# EAGLE design Board (EAGLE 8.2.2)
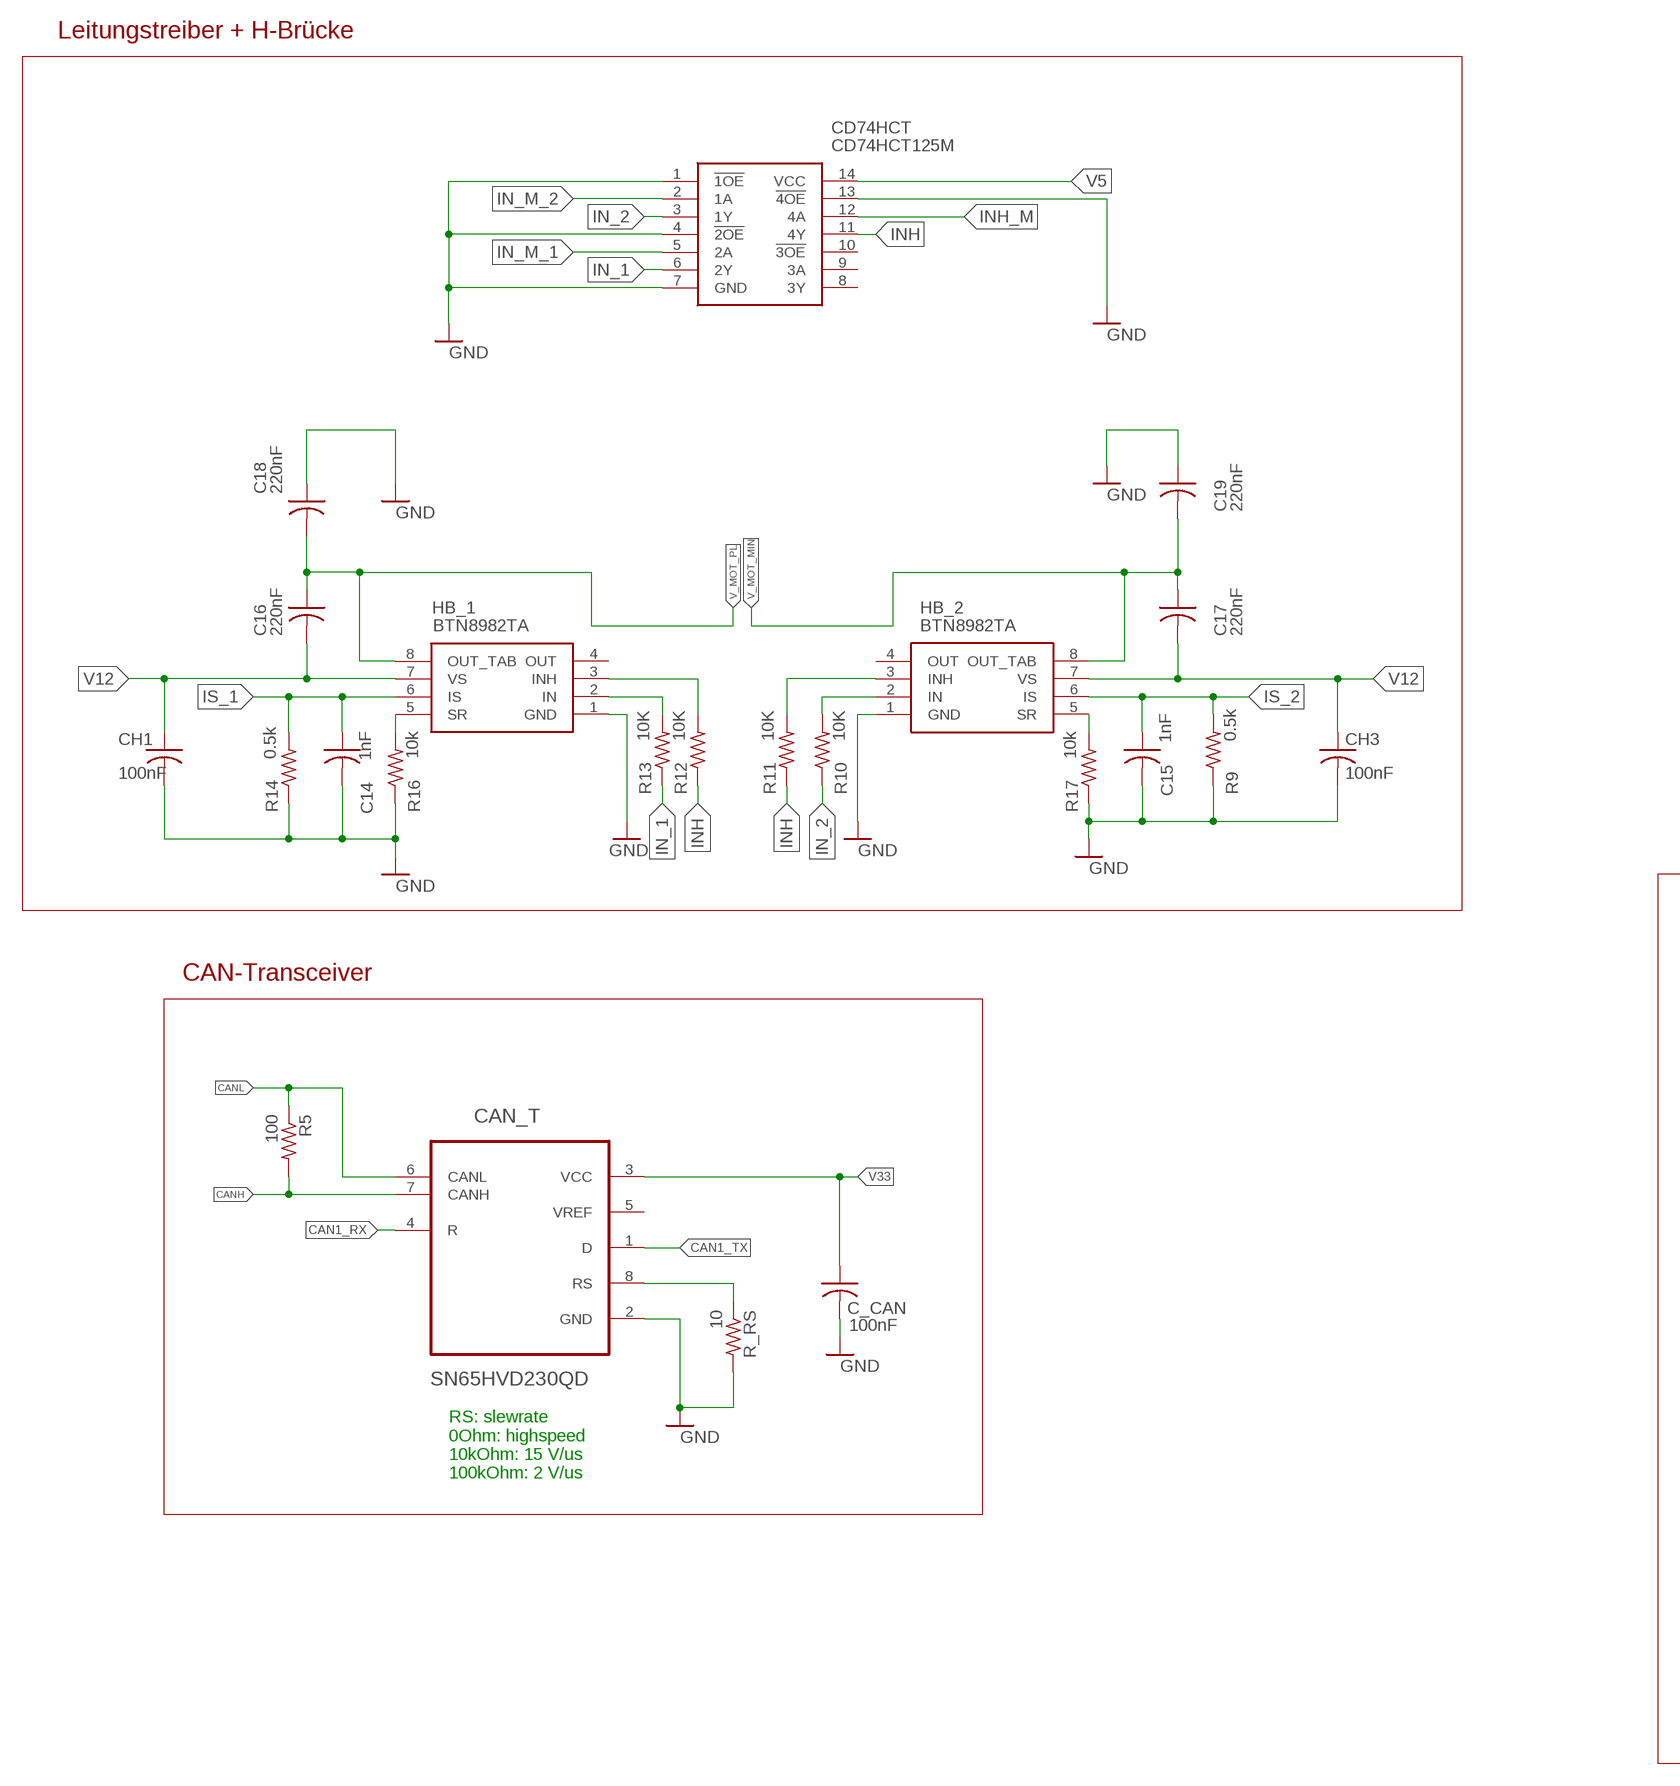
[diagram p0: schematic, sheet 1, part 1 of 2]
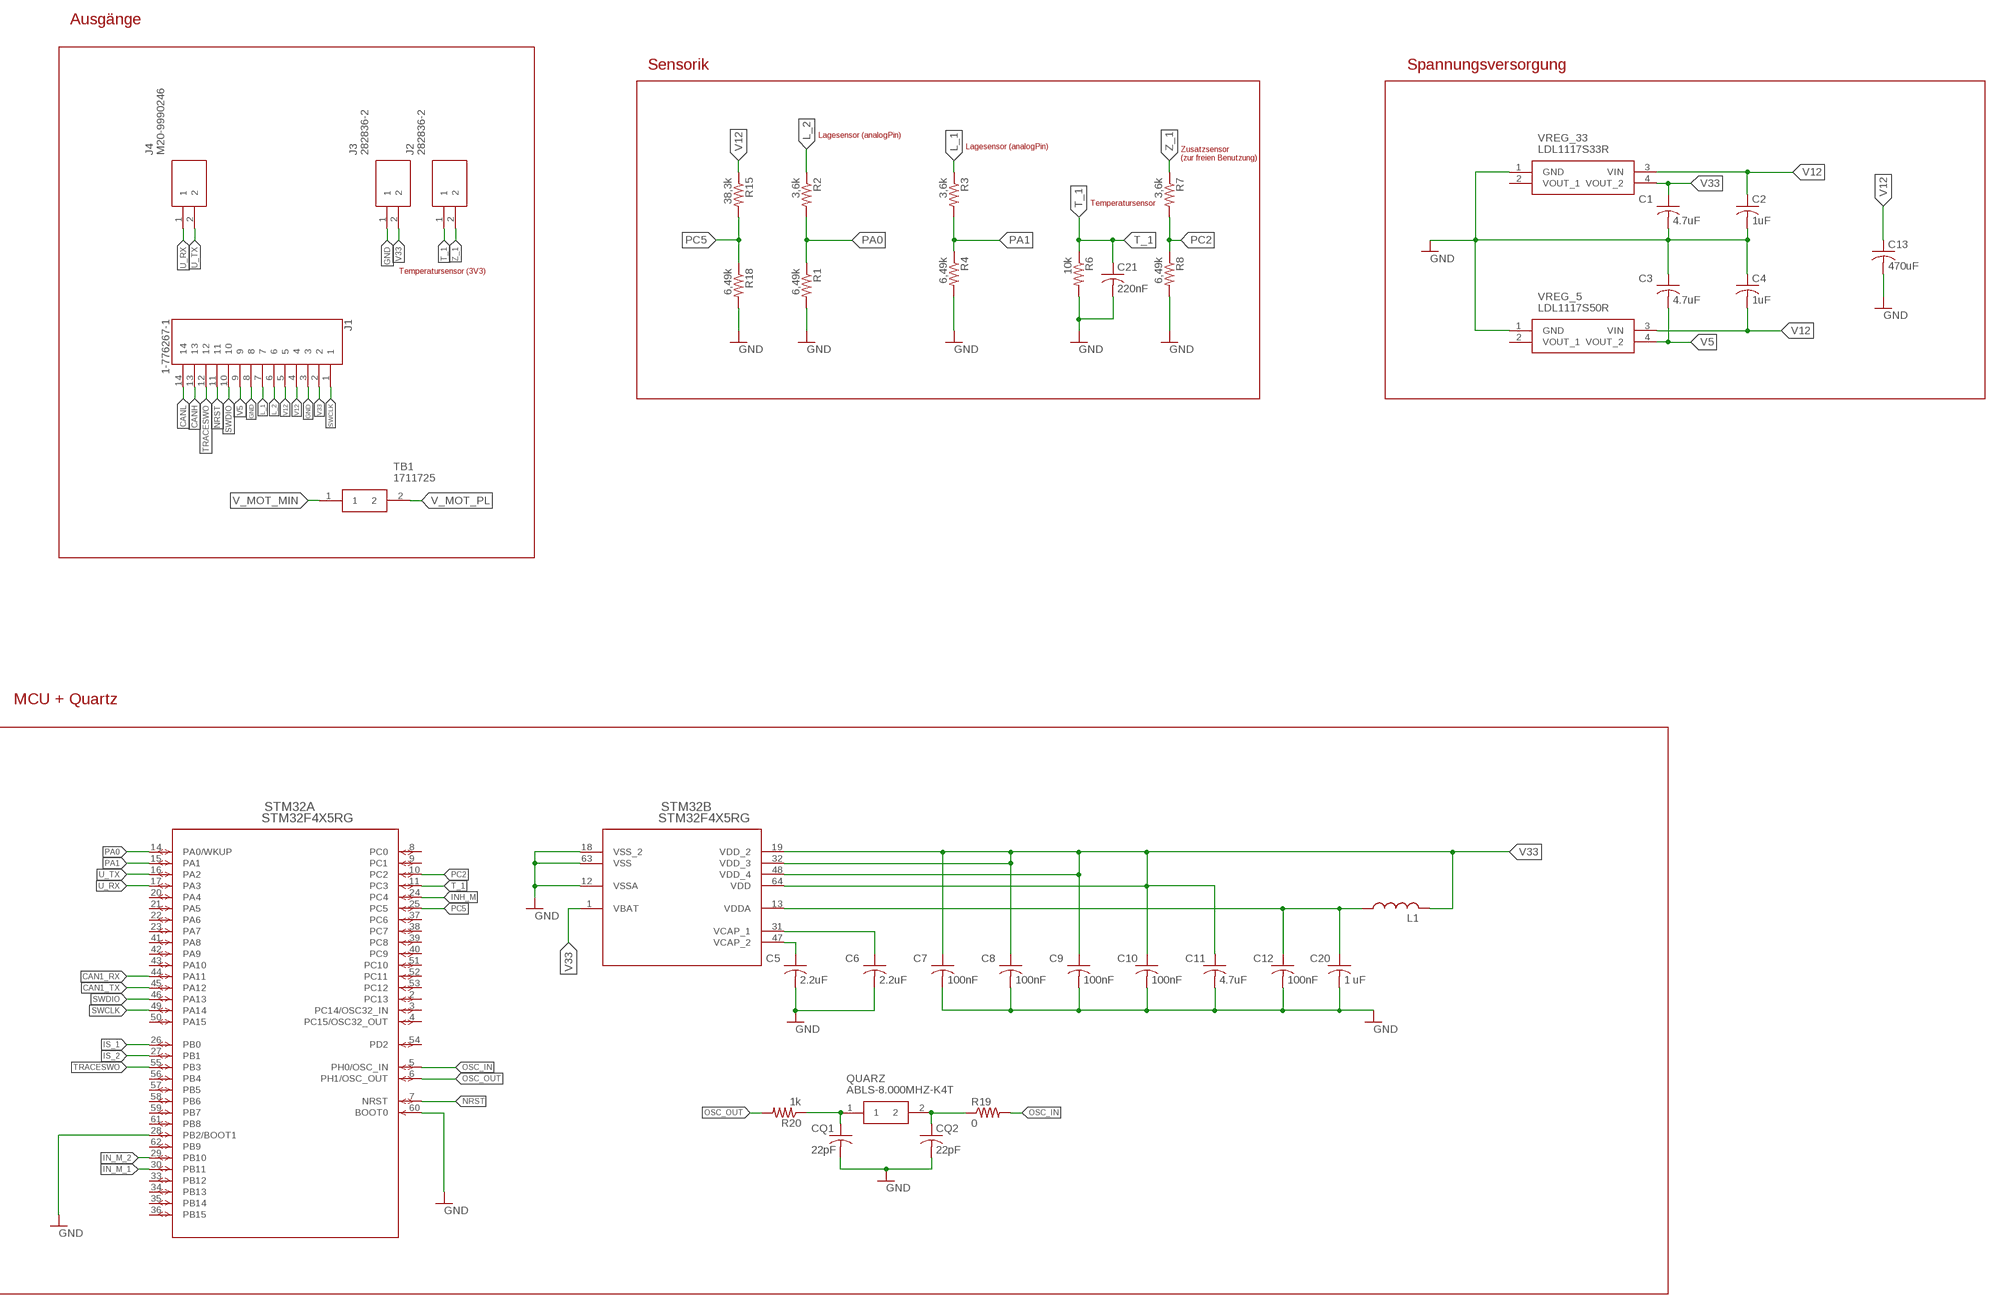
[diagram p1: schematic, sheet 1, part 2 of 2]

## Parts
C1  4.7uF  C-USC1206  [C1206]
C2  1uF  C-USC1206  [C1206]
C3  4.7uF  C-USC1206  [C1206]
C4  1uF  C-USC1206  [C1206]
C5  2.2uF  C-USC1206  [C1206]
C6  2.2uF  C-USC1206  [C1206]
C7  100nF  C-USC1206  [C1206]
C8  100nF  C-USC1206  [C1206]
C9  100nF  C-USC1206  [C1206]
C10  100nF  C-USC1206  [C1206]
C11  4.7uF  C-USC1206  [C1206]
C12  100nF  C-USC1206  [C1206]
C13  470uF  C-US050-075X075  [C050-075X075]
C14  1nF  C-USC1206  [C1206]
C15  1nF  C-USC1206  [C1206]
C16  220nF  C-USC1206  [C1206]
C17  220nF  C-USC1206  [C1206]
C18  220nF  C-USC1206  [C1206]
C19  220nF  C-USC1206  [C1206]
C20  1 uF  C-USC1206  [C1206]
C21  220nF  C-USC1206  [C1206]
C_CAN  100nF  C-USC1206  [C1206]
CAN_T  SN65HVD230QD  [SOIC127P600X175-8N]
CD74HCT  CD74HCT125M  [SOIC127P600X175-14N]
CH1  100nF  C-USC1206  [C1206]
CH3  100nF  C-USC1206  [C1206]
CQ1  22pF  C-USC0805  [C0805]
CQ2  22pF  C-USC0805  [C0805]
HB_1  BTN8982TA  [TO127P1500X440-8N]
HB_2  BTN8982TA  [TO127P1500X440-8N]
J1  1-776267-1  [TE_1-776267-1]
J2  282836-2  [SHDR2W100P0X500_1X2_1000X820X1]
J3  282836-2  [SHDR2W100P0X500_1X2_1000X820X1]
J4  M20-9990246  [HDRV2W64P0X254_1X2_508X254X864]
L1  INDUCTOR_0805_N  [RESC0805_N]
QUARZ  ABLS-8.000MHZ-K4T  [ABLS-12.000MHZ-B2]
R1  6,49k  R-US_R1206  [R1206]
R2  3,6k  R-US_R1206  [R1206]
R3  3,6k  R-US_R1206  [R1206]
R4  6,49k  R-US_R1206  [R1206]
R5  100  R-US_R1206  [R1206]
R6  10k  R-US_R1206  [R1206]
R7  3,6k  R-US_R1206  [R1206]
R8  6,49k  R-US_R1206  [R1206]
R9  0.5k  R-US_R1206  [R1206]
R10  10K  R-US_R1206  [R1206]
R11  10K  R-US_R1206  [R1206]
R12  10K  R-US_R1206  [R1206]
R13  10K  R-US_R1206  [R1206]
R14  0.5k  R-US_R1206  [R1206]
R15  38,3k  R-US_R1206  [R1206]
R16  10k  R-US_R0805  [R0805]
R17  10k  R-US_R0805  [R0805]
R18  6,49k  R-US_R1206  [R1206]
R19  0  R-US_R0805  [R0805]
R20  1k  R-US_R0805  [R0805]
R_RS  10  R-US_R1206  [R1206]
STM32  STM32F4X5RG  [LQFP64-10X10MM]
TB1  1711725  [PHEONIX-5.08PITCH-2PIN]
VREG_5  LDL1117S50R  [SOT230P700X180-4N]
VREG_33  LDL1117S33R  [SOT230P700X180-4N]

## Nets
CAN1_RX: CAN_T.4(R) STM32.44(A:PA11)
CAN1_TX: CAN_T.1(D) STM32.45(A:PA12)
CAN_RS: CAN_T.8(RS) R_RS.1
CANH: CAN_T.7(CANH) J1.13 R5.2
CANL: CAN_T.6(CANL) J1.14 R5.1
GND: C1.2 C2.2 C3.1 C4.1 C5.2 C6.2 C7.2 C8.2 C9.2 C10.2 C11.2 C12.2 C13.2 C14.2 C15.2 C18.1 C19.1 C20.2 C21.2 C_CAN.2 CAN_T.2(GND) CD74HCT.1(!1OE) CD74HCT.4(!2OE) CD74HCT.7(GND) CD74HCT.13(!4OE) CH1.2 CH3.2 CQ1.2 CQ2.2 HB_1.1(GND) HB_2.1(GND) J1.3 J1.8 J3.1 R1.2 R4.2 R6.2 R8.2 R9.1 R14.1 R16.1 R17.1 R18.2 R_RS.2 STM32.12(B:VSSA) STM32.18(B:VSS_2) STM32.28(A:PB2/BOOT1) STM32.60(A:BOOT0) STM32.63(B:VSS) VREG_5.1(GND) VREG_33.1(GND)
HB1_IN: HB_1.2(IN) R13.2
HB1_INH: HB_1.3(INH) R12.2
HB2_IN: HB_2.2(IN) R10.2
HB2_INH: HB_2.3(INH) R11.2
IN_1: CD74HCT.6(2Y) R13.1
IN_2: CD74HCT.3(1Y) R10.1
IN_M_1: CD74HCT.5(2A) STM32.30(A:PB11)
IN_M_2: CD74HCT.2(1A) STM32.29(A:PB10)
INH: CD74HCT.11(4Y) R11.1 R12.1
INH_M: CD74HCT.12(4A) STM32.24(A:PC4)
IS_1: C14.1 HB_1.6(IS) R14.2 STM32.26(A:PB0)
IS_2: C15.1 HB_2.6(IS) R9.2 STM32.27(A:PB1)
L_1: J1.7 R3.1
L_2: J1.6 R2.1
NRST: J1.11 STM32.7(A:NRST)
OSC_IN: R19.2 STM32.5(A:PH0/OSC_IN)
OSC_OUT: R20.2 STM32.6(A:PH1/OSC_OUT)
PA0: R1.1 R2.2 STM32.14(A:PA0/WKUP)
PA1: R3.2 R4.1 STM32.15(A:PA1)
PC2: R7.2 R8.1 STM32.10(A:PC2)
PC5: R15.2 R18.1 STM32.25(A:PC5)
Q_IN: CQ2.1 QUARZ.2 R19.1
Q_OUT: CQ1.1 QUARZ.1 R20.1
SR1: HB_1.5(SR) R16.2
SR2: HB_2.5(SR) R17.2
SWCLK: J1.1 STM32.49(A:PA14)
SWDIO: J1.10 STM32.46(A:PA13)
T_1: C21.1 J2.1 R6.1 STM32.11(A:PC3)
TRACESWO: J1.12 STM32.55(A:PB3)
U_RX: J4.1 STM32.17(A:PA3)
U_TX: J4.2 STM32.16(A:PA2)
V5: C3.2 CD74HCT.14(VCC) J1.9 VREG_5.4(VOUT_2)
V12: C2.1 C4.2 C13.1 C16.2 C17.2 CH1.1 CH3.1 HB_1.7(VS) HB_2.7(VS) J1.4 J1.5 R15.1 VREG_5.3(VIN) VREG_33.3(VIN)
V33: C1.1 C7.1 C8.1 C9.1 C10.1 C11.1 C_CAN.1 CAN_T.3(VCC) J1.2 J3.2 L1.2 STM32.1(B:VBAT) STM32.19(B:VDD_2) STM32.32(B:VDD_3) STM32.48(B:VDD_4) STM32.64(B:VDD) VREG_33.4(VOUT_2)
V_MOT_MIN: C17.1 C19.2 HB_2.8(OUT_TAB) TB1.1
V_MOT_PL: C16.1 C18.2 HB_1.8(OUT_TAB) TB1.2
VCAP_1: C6.1 STM32.31(B:VCAP_1)
VCAP_2: C5.1 STM32.47(B:VCAP_2)
VDDA: C12.1 C20.1 L1.1 STM32.13(B:VDDA)
Z_1: J2.2 R7.1
Unconnected: CAN_T.5(VREF) CD74HCT.8(3Y) CD74HCT.9(3A) CD74HCT.10(!3OE) HB_1.4(OUT) HB_2.4(OUT) STM32.2(A:PC13) STM32.3(A:PC14/OSC32_IN) STM32.4(A:PC15/OSC32_OUT) STM32.8(A:PC0) STM32.9(A:PC1) STM32.20(A:PA4) STM32.21(A:PA5) STM32.22(A:PA6) STM32.23(A:PA7) STM32.33(A:PB12) STM32.34(A:PB13) STM32.35(A:PB14) STM32.36(A:PB15) STM32.37(A:PC6) STM32.38(A:PC7) STM32.39(A:PC8) STM32.40(A:PC9) STM32.41(A:PA8) STM32.42(A:PA9) STM32.43(A:PA10) STM32.50(A:PA15) STM32.51(A:PC10) STM32.52(A:PC11) STM32.53(A:PC12) STM32.54(A:PD2) STM32.56(A:PB4) STM32.57(A:PB5) STM32.58(A:PB6) STM32.59(A:PB7) STM32.61(A:PB8) STM32.62(A:PB9) VREG_5.2(VOUT_1) VREG_33.2(VOUT_1)

## Notes on the sheet
- Ausgänge
- Sensorik | Spannungsversorgung
- Lagesensor (analogPin)
- Lagesensor (analogPin)
- Zusatzsensor
  (zur freien Benutzung)
- Leitungstreiber + H-Brücke
- Temperatursensor
- Temperatursensor (3V3)
- MCU + Quartz
- CAN-Transceiver
- RS: slewrate
  0Ohm: highspeed
  10kOhm: 15 V/us
  100kOhm: 2 V/us

## Library data of the parts
C1-C21 C_CAN CH1 CH3 CQ1 CQ2 = adafruit:C-US: CAPACITOR, American symbol
CAN_T = ADP_Components:SN65HVD230QD: 3.3-V CAN TRANSCEIVERS; MF: TEXAS INSTRUMENTS; MPN: SN65HVD230QD..; OC_FARNELL: 1648752; OC_NEWARK: 75C7746; PACKAGE: SOIC-8; SUPPLIER: Texas Instruments
CD74HCT = SamacSys_Parts:CD74HCT125M: High Speed CMOS Logic Quad Buffers with 3-State Outputs Source: Datasheet <http://www.ti.com/lit/ds/symlink/cd74hct125.pdf>; DESCRIPTION: High Speed CMOS Logic Quad Buffers with 3-State Outputs; HEIGHT: 1.75mm; MANUFACTURER_NAME: Texas Instruments; MANUFACTURER_PART_NUMBER: CD74HCT125M; MOUSER_PART_NUMBER: 595-CD74HCT125M
HB_1 HB_2 = SamacSys_Parts:BTN8982TA: New Infineon BTN8982TA Motor Driver,, 7-Pin TO-263-7-1 Source: Datasheet <http://www.mouser.com/datasheet/2/196/Infineon-BTN8982TA-DS-v01_00-EN-786008.pdf>; DESCRIPTION: New Infineon BTN8982TA Motor Driver,, 7-Pin TO-263-7-1; HEIGHT: 4.4mm; MANUFACTURER_NAME: Infineon; MANUFACTURER_PART_NUMBER: BTN8982TA; MOUSER_PART_NUMBER: 726-BTN8982TA
J1 = 1-776267-1:1-776267-1: AMPSEAL 14 Position 4 mm Pitch Triple Row Wire to Board Right Angle Header; COMMENT: 1-776267-1; DESCRIPTION: AMPSEAL 14 Position 4 mm Pitch Triple Row Wire to Board Right Angle Header; DIGI-KEY_PART_NUMBER: A142413-ND; DIGI-KEY_PURCHASE_URL: https://www.digikey.com/product-detail/en/te-connectivity-amp-connectors/1-776267-1/A142413-ND/5428565?utm_source=snapeda&utm_medium=aggregator&utm_campaign=symbol; EU_ROHS_COMPLIANCE: Compliant; MF: TE Connectivity; MP: 1-776267-1; PACKAGE: None; TE_PURCHASE_URL: https://www.te.com/usa-en/product-1-776267-1.html?te_bu=Cor&te_type=disp&te_campaign=seda_glo_cor-seda-global-disp-prtnr-fy19-seda-model-bom-cta_sma-317_1&elqCampaignId=32493
J2 J3 = SamacSys_Parts:282836-2: TERMINAL BLOCK, PCB MOUNT, SIDE WIRE ENTRY, STACKING , 5.00mm PITCH Source: Datasheet <http://www.mouser.com/datasheet/2/418/NG_CD_282836_H10-1248046.pdf>; DESCRIPTION: TERMINAL BLOCK, PCB MOUNT, SIDE WIRE ENTRY, STACKING , 5.00mm PITCH; HEIGHT: 10.2mm; MANUFACTURER_NAME: TE Connectivity; MANUFACTURER_PART_NUMBER: 282836-2; MOUSER_PART_NUMBER: 571-2828362
J4 = SamacSys_Parts:M20-9990246: HARWIN M20-9990246. Board-To-Board Connector, Straight, 2.54 mm, 2 Contacts, Header, M20 Series, Through Hole Source: Datasheet <http://www.mouser.com/datasheet/2/181/M20-999-1218971.pdf>; DESCRIPTION: HARWIN M20-9990246. Board-To-Board Connector, Straight, 2.54 mm, 2 Contacts, Header, M20 Series, Through Hole; HEIGHT: 8.64mm; MANUFACTURER_NAME: HARWIN; MANUFACTURER_PART_NUMBER: M20-9990246; MOUSER_PART_NUMBER: 855-M20-9990246
L1 = Nordic_nRF:INDUCTOR: Generic chip inductor
QUARZ = SamacSys_Parts:ABLS-8.000MHZ-K4T: ABRACON - ABLS-8.000MHZ-K4T - CRYSTAL, 8MHZ, 18PF, HC-49US Source: Datasheet <https://componentsearchengine.com/Datasheets/1/ABLS-8.000MHZ-K4T.pdf>; DESCRIPTION: ABRACON - ABLS-8.000MHZ-K4T - CRYSTAL, 8MHZ, 18PF, HC-49US; HEIGHT: mm; MANUFACTURER_NAME: ABRACON; MANUFACTURER_PART_NUMBER: ABLS-8.000MHZ-K4T; MF: ABRACON; MOUSER_PART_NUMBER: 815-ABLS-8.0MK4-T; MPN: ABLS-8.000MHZ-K4T; OC_FARNELL: 2467758
R1-R15 R18 R_RS = adafruit:R-US_: RESISTOR, American symbol
R16 R17 R19 R20 = resistor:R-US_: RESISTOR, American symbol
STM32 = ADP_Components:STM32F4X5RG; MANUFACTURER_PART_NUMBER: STM32F4X5RG; OC_FARNELL: unknown; VENDOR: STMicroelectronics
TB1 = SamacSys_Parts:1711725: Non-Fused Terminal Block Through Hole, 2 Way, Solder, Nylon, 250 V Source: Datasheet; DESCRIPTION: Non-Fused Terminal Block Through Hole, 2 Way, Solder, Nylon, 250 V; HEIGHT: mm; MANUFACTURER_NAME: Phoenix Contact; MANUFACTURER_PART_NUMBER: 1711725; MOUSER_PART_NUMBER: 651-1711725; MOUSER_PRICE-STOCK: https://www.mouser.com/Search/Refine.aspx?Keyword=651-1711725
VREG_5 = SamacSys_Parts:LDL1117S50R: STMICROELECTRONICS - LDL1117S50R - LDO, FIXED, 5V, 1.2A, SOT-223-3 Source: Datasheet <http://www.mouser.com/datasheet/2/389/ldl1117-1156241.pdf>; DESCRIPTION: STMICROELECTRONICS - LDL1117S50R - LDO, FIXED, 5V, 1.2A, SOT-223-3; HEIGHT: 1.8mm; MANUFACTURER_NAME: STMicroelectronics; MANUFACTURER_PART_NUMBER: LDL1117S50R; MF: STMICROELECTRONICS; MOUSER_PART_NUMBER: 511-LDL1117S50R; MPN: LDL1117S50R; OC_FARNELL: 2729709
VREG_33 = SamacSys_Parts:LDL1117S33R: STMICROELECTRONICS - LDL1117S33R - LDO, FIXED, 3.3V, 1.2A, SOT-223-3 Source: Datasheet <http://www.mouser.com/datasheet/2/389/ldl1117-1156241.pdf>; DESCRIPTION: STMICROELECTRONICS - LDL1117S33R - LDO, FIXED, 3.3V, 1.2A, SOT-223-3; HEIGHT: 1.8mm; MANUFACTURER_NAME: STMicroelectronics; MANUFACTURER_PART_NUMBER: LDL1117S33R; MF: STMICROELECTRONICS; MOUSER_PART_NUMBER: 511-LDL1117S33R; MPN: LDL1117S33R; OC_FARNELL: 2729708

## Net classes
0 default: width 0.2 mm, drill 0.508 mm
1 V12: width 0.6 mm, drill 0.8 mm

## Board
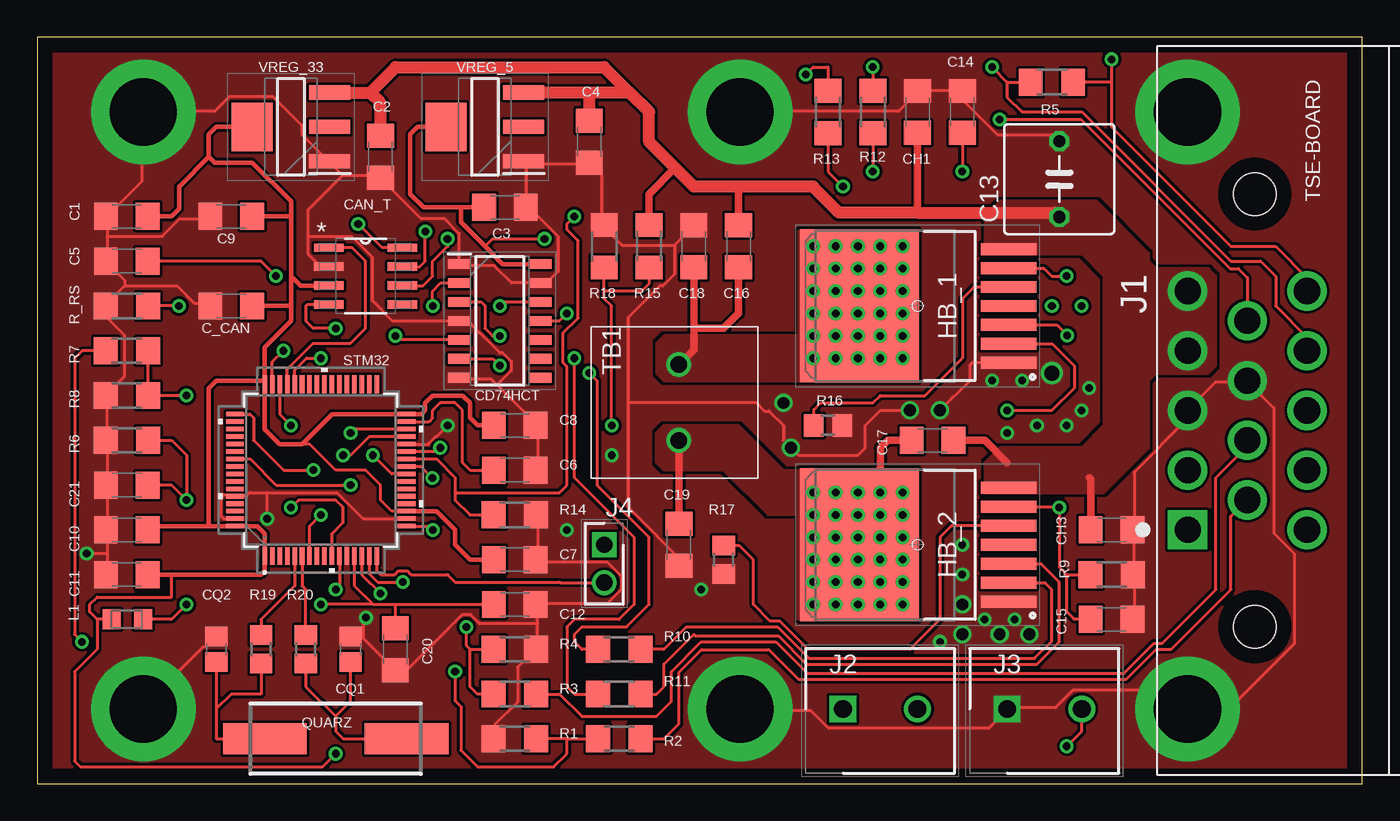
[diagram p2: board, top side]
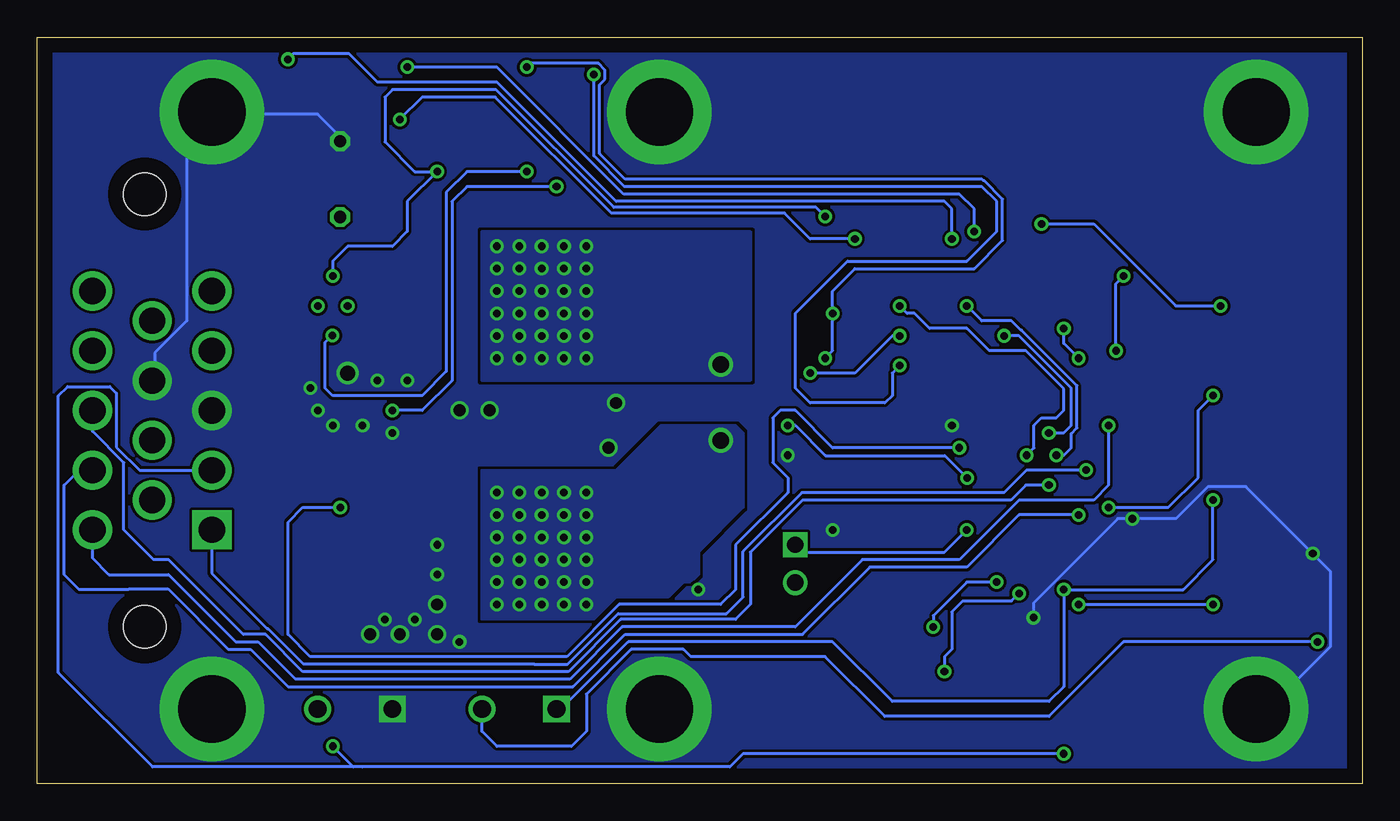
[diagram p3: board, bottom side, seen from below]

Size 88.8 x 50 mm. Coordinates in mm from the lower left corner, seen from the top.
Outline: 0,0 88.8,0 88.8,50 0,50 0,0
Copper layers (1*16): Top 0.07mm / dielectric 1.5mm / Bottom 0.07mm
Design rules "default *": minimum track width 6mil, minimum drill 0.35mm, track to track 0.19mm, track to pad 0.19mm, pad to pad 0.19mm, via to via 0.19mm, smd to smd 0.19mm, copper to edge 40mil, drill to drill 6mil, minimum pad ring 10mil, minimum via ring 8mil, stop-mask expansion 4mil, vias tented up to drill 0mil, thermal gap 10mil

### Footprints (pad centres in the part's own frame; a part is rotated, then mirrored left to right if it is on the bottom)
C1206 = smd 1.6 x 1.8: 1 -1.4,0; 2 1.4,0
C050-075X075 = drill 0.813 octagon: 1 -2.54,0; 2 2.54,0
SOIC127P600X175-8N = smd 1.981 x 0.559: 1 -2.464,1.905; 2 -2.464,0.635; 3 -2.464,-0.635; 4 -2.464,-1.905; 5 2.464,-1.905; 6 2.464,-0.635; 7 2.464,0.635; 8 2.464,1.905
SOIC127P600X175-14N = smd 1.525 x 0.65: 1 -2.712,3.81; 2 -2.712,2.54; 3 -2.712,1.27; 4 -2.712,0; 5 -2.712,-1.27; 6 -2.712,-2.54; 7 -2.712,-3.81; 8 2.712,-3.81; 9 2.712,-2.54; 10 2.712,-1.27; 11 2.712,0; 12 2.712,1.27; 13 2.712,2.54; 14 2.712,3.81
C0805 = smd 1.3 x 1.5: 1 -0.85,0; 2 0.85,0
TO127P1500X440-8N = smd 3.7 x 0.8: 1 -6.1,3.81; 2 -6.1,2.54; 3 -6.1,1.27; 4 -6.1,0; 5 -6.1,-1.27; 6 -6.1,-2.54; 7 -6.1,-3.81 | smd 8 x 10.25: 8 3.9,0
TE_1-776267-1 = drill 1.75 square: 1 -8,4.5 | drill 1.75: 2 -4,4.5; 3 0,4.5; 4 4,4.5; 5 8,4.5; 6 -6,0.5; 7 -2,0.5; 8 2,0.5; 9 6,0.5; 10 -8,-3.5; 11 -4,-3.5; 12 0,-3.5; 13 4,-3.5; 14 8,-3.5 | hole 2.85: -14.5,0; 14.5,0
SHDR2W100P0X500_1X2_1000X820X1 = drill 1.2 pad 1.8 square: 1 0,0 | drill 1.2 pad 1.8: 2 5,0
HDRV2W64P0X254_1X2_508X254X864 = drill 1.1 pad 1.65 square: 1 0,0 | drill 1.1 pad 1.65: 2 2.54,0
RESC0805_N = smd 1.2 x 1.35: 1 -1.1,0; 2 1,0
ABLS-12.000MHZ-B2 = smd 5.6 x 2.1: 1 -4.75,0; 2 4.75,0
R1206 = smd 1.6 x 1.803: 1 -1.422,0; 2 1.422,0
R0805 = smd 1.3 x 1.5: 1 -0.95,0; 2 0.95,0
LQFP64-10X10MM = smd 1.194 x 0.305: 1 -5.75,3.75; 2 -5.75,3.25; 3 -5.75,2.75; 4 -5.75,2.25; 5 -5.75,1.75; 6 -5.75,1.25; 7 -5.75,0.75; 8 -5.75,0.25; 9 -5.75,-0.25; 10 -5.75,-0.75; 11 -5.75,-1.25; 12 -5.75,-1.75; 13 -5.75,-2.25; 14 -5.75,-2.75; 15 -5.75,-3.25; 16 -5.75,-3.75; 33 5.75,-3.75; 34 5.75,-3.25; 35 5.75,-2.75; 36 5.75,-2.25; 37 5.75,-1.75; 38 5.75,-1.25; 39 5.75,-0.75; 40 5.75,-0.25; 41 5.75,0.25; 42 5.75,0.75; 43 5.75,1.25; 44 5.75,1.75; 45 5.75,2.25; 46 5.75,2.75; 47 5.75,3.25; 48 5.75,3.75 | smd 0.305 x 1.194: 17 -3.75,-5.75; 18 -3.25,-5.75; 19 -2.75,-5.75; 20 -2.25,-5.75; 21 -1.75,-5.75; 22 -1.25,-5.75; 23 -0.75,-5.75; 24 -0.25,-5.75; 25 0.25,-5.75; 26 0.75,-5.75; 27 1.25,-5.75; 28 1.75,-5.75; 29 2.25,-5.75; 30 2.75,-5.75; 31 3.25,-5.75; 32 3.75,-5.75; 49 3.75,5.75; 50 3.25,5.75; 51 2.75,5.75; 52 2.25,5.75; 53 1.75,5.75; 54 1.25,5.75; 55 0.75,5.75; 56 0.25,5.75; 57 -0.25,5.75; 58 -0.75,5.75; 59 -1.25,5.75; 60 -1.75,5.75; 61 -2.25,5.75; 62 -2.75,5.75; 63 -3.25,5.75; 64 -3.75,5.75
PHEONIX-5.08PITCH-2PIN = drill 1.1 pad 1.65: 1 0,0; 2 5.08,0
SOT230P700X180-4N = smd 2.75 x 0.95: 1 -2.6,2.3; 2 -2.6,0; 3 -2.6,-2.3 | smd 2.75 x 3.25: 4 2.6,0

### Placement (x,y rotation side)
C1  6,38 180 top
C2  23,42 270 top
C3  31.34,38.61 180 top
C4  37,43 90 top
C5  6,35 180 top
C6  32,21 0 top
C7  32,15 0 top
C8  32,24 0 top
C9  13,38 180 top
C10  6,17 180 top
C11  6,14 180 top
C12  32,12 0 top
C13  68.5,40.5 90 top
C14  62,45 90 top
C15  72,11 0 top
C16  47,36 90 top
C17  60,23 0 top
C18  44,36 270 top
C19  43,16 90 top
C20  24,9 270 top
C21  6,20 180 top
C_CAN  13,32 180 top
CAN_T  22,34 0 top
CD74HCT  31,31 0 top
CH1  59,45 90 top
CH3  72,17 0 top
CQ1  21,9 90 top
CQ2  12,9 90 top
HB_1  59,32 180 top
HB_2  59,16 180 top
J1  81.6,25 90 top
J2  54,5 0 top
J3  65,5 0 top
J4  38,16 270 top
L1  6,11 180 top
QUARZ  20,3 180 top
R1  32,3 180 top
R2  39,3 180 top
R3  32,6 180 top
R4  32,9 0 top
R5  68,47 180 top
R6  6,23 180 top
R7  6,29 0 top
R8  6,26 180 top
R9  72,14 180 top
R10  39,9 0 top
R11  39,6 0 top
R12  56,45 270 top
R13  53,45 270 top
R14  32,18 180 top
R15  41,36 270 top
R16  53,24 180 top
R17  46,15 90 top
R18  38,36 90 top
R19  15,9 90 top
R20  18,9 90 top
R_RS  6,32 180 top
STM32  19,21 90 top
TB1  43,23 90 top
VREG_5  30,44 180 top
VREG_33  17,44 180 top

### Tracks (layer width: path | path; a pad name or v marks a point on that pad's centre or on a via)
CAN1_RX  (via drill 0.51)
  Top 0.2: STM32.44 17.25,27.7 18.05,28.5 v19,28.5 | v20,30.5 18.5,30.5 18,31 18,32 18.09,32.09 CAN_T.4
  Bottom 0.2: v19,28.5 20,29.5 v20,30.5
CAN1_TX
  Top 0.2: STM32.45 16.75,27.75 18.5,29.5 21,29.5 22,30.5 22,35 21.09,35.91 CAN_T.1
CAN_RS  (via drill 0.51)
  Top 0.2: v9.5,32 R_RS.1 | CAN_T.8 23.09,35.91 v21.5,37.5
  Bottom 0.2: v9.5,32 12.5,32 18,37.5 v21.5,37.5
CANH  (via drill 0.51)
  Top 0.2: CAN_T.7 25.64,34.63 26,35 v26,37 | v64,48 65,47 | 65,47 R5.2 | 65,47 65,46 66,45 70,45 80,35 82,35 83,34 83,32 85.1,29.9 J1.13
  Bottom 0.2: v26,37 26,38.5 27,39.5 49.5,39.5 58,48 v64,48
CANL  (via drill 0.51)
  Top 0.2: CAN_T.6 25.86,33.37 26.5,34 26.5,35 27.5,36 v27.5,36.5 | v72,48.53 72,47 | 72,47 R5.1 | 72,47 72,44 80,36 83,36 85.1,33.9 J1.14
  Bottom 0.2: v27.5,36.5 27.5,38.5 28,39 50,39 58,47 66,47 67.88,48.88 71.64,48.88 v72,48.53
GND  (via drill 0.51, 0.8, 1, 4.5 pad 7)
  Top 0.2: v47.1,5 47.19,4.88 51.87,4.88 53.04,3.71 63.77,3.71 64.94,4.88 J3.1 65.13,5.07 68.25,5.07 69.42,6.24 75.86,6.24 77.03,5.07 v77.1,5 77.22,5.07 79.95,5.07 84.24,9.36 84.24,15.4 82.88,16.77 82.88,25.16 81.12,26.91 J1.8 80.92,26.91 78.97,26.91 77.22,25.16 J1.3 77.03,24.96 77.03,24.38 73.52,20.86 73.52,17.16 CH3.2 73.52,16.96 73.52,14.04 R9.1 73.52,13.85 73.52,11.12 C15.2 | v47.1,45 47.19,45.05 57.72,45.05 58.89,46.22 CH1.2 59.09,46.41 61.81,46.41 C14.2 62.01,46.22 62.01,45.83 64.35,43.48 68.06,43.48 C13.2 | 21.84,9.75 21.06,9.75 CQ1.2 | 21.84,9.75 23.98,7.61 C20.2 24.18,7.61 24.77,7.61 28.47,11.31 29.05,11.31 29.64,10.72 33.54,10.72 | R14.1 33.54,17.94 33.54,15.02 C7.2 33.54,14.82 38.22,14.82 39.2,13.85 39.2,13.06 38.22,12.09 33.54,12.09 C12.2 33.54,11.89 33.54,10.72 | 33.54,10.72 33.54,9.16 R4.2 33.34,8.97 32.17,7.8 32.17,5.46 30.61,3.9 30.61,3.12 R1.2 | 5.85,33.34 9.36,33.34 10.53,32.17 11.51,32.17 C_CAN.2 | 5.85,33.34 4.68,32.17 R_RS.2 4.68,31.98 4.68,31.2 5.85,30.03 5.85,27.3 4.68,26.13 R8.2 4.68,25.93 4.68,23.01 R6.2 4.68,22.82 4.68,20.09 C21.2 4.68,19.89 4.68,17.16 C10.2 4.68,16.96 4.68,15.4 | 4.68,36.66 4.68,37.83 C1.2 4.68,38.02 7.02,40.37 7.02,44.85 v7.1,45 7.21,45.05 11.89,45.05 12.87,46.02 15.79,46.02 17.75,44.07 17.75,43.48 19.5,41.73 VREG_33.1 19.7,41.53 20.48,40.76 | 4.68,36.66 4.68,35.1 C5.2 4.68,34.91 5.85,33.73 5.85,33.34 | 4.68,36.66 8.38,36.66 9.55,37.83 11.51,37.83 C9.2 | STM32.63 13.06,17.75 12.48,17.75 12.29,17.94 12.29,19.11 12.48,19.3 13.06,19.3 STM32.60 13.26,19.3 14.04,19.3 14.23,19.5 15.4,19.5
  Top 0.2: 15.4,19.5 20.09,19.5 21.84,17.75 24.57,17.75 STM32.18 | CQ2.2 11.89,9.75 11.31,9.16 11.12,9.16 7.02,5.07 v7.1,5 | 4.68,15.4 4.68,14.04 C11.2 | 4.68,15.4 v3.31,15.4 | v15.4,17.75 15.4,19.5 | 21.84,9.75 21.84,10.92 v22.04,11.12 | 39.59,25.55 39.59,31.2 41.73,33.34 41.92,33.34 42.7,34.12 42.7,36.08 | 39.59,25.55 39.59,18.56 41.53,16.61 41.53,16.57 42.9,15.21 42.9,14.62 C19.1 | 42.7,36.08 43.88,37.24 C18.1 | 30.81,26.71 33.34,24.18 C8.2 33.54,23.98 33.54,21.06 C6.2 | 30.81,26.71 30.42,27.11 28.47,27.11 CD74HCT.7 | 30.81,26.71 31.79,27.69 31.79,28.27 31.2,28.86 31,28.86 29.05,30.81 28.47,30.81 CD74HCT.4 28.27,31 23.79,31 22.43,32.37 22.43,35.3 21.06,36.66 18.14,36.66 | 20.48,40.76 22.82,40.76 C2.2 23.01,40.56 25.74,37.83 27.3,37.83 28.27,36.85 28.27,34.91 CD74HCT.1 28.47,34.71 30.61,34.71 31.79,33.54 CD74HCT.13 34.12,33.54 34.91,34.32 34.91,36.66 32.76,38.8 | 18.14,36.66 18.14,38.41 20.48,40.76 | 18.14,36.66 18.14,35.49 18.91,34.71 19.5,34.71 CAN_T.2 | 32.76,41.53 32.76,38.8 | 32.76,38.8 32.76,38.61 C3.1 32.76,38.8 | 32.76,41.53 36.85,41.53 C4.1 37.05,41.53 37.83,40.76 37.83,37.44 R18.2 38.02,37.24 39.2,36.08 42.7,36.08 | 32.76,41.53 VREG_5.1 | 39.59,25.55 48.16,25.55 48.75,24.96 49.04,24.96 50,24 50,23 | STM32.28 26.25,22.75 26.25,22.81 26.69,23.25 26.75,23.25 v27.5,24 | 51,22 55,22 55.5,22.5 55.5,24 56.5,25 v58.5,25 | 60.46,24.96 v60.5,25 62.5,27 62.5,28 62.69,28.19 HB_1.1
  Bottom 0.2: J1.8 80.92,27.11 80.92,28.86 78.78,31 78.78,43.29 77.22,44.85 v77.1,45 77.03,44.85 70,44.85 68.5,43.34 C13.2 | v7.1,5 7.02,5.07 6.24,5.07 2.15,9.16 2.15,14.23 v3.31,15.4 7.8,19.89 10.34,19.89 12.48,17.75 v15.4,17.75 16.38,17.75 22.04,12.09 v22.04,11.12
  other vias: 68,27.5 62,10 64.5,10 66.5,10 50.5,22.5 50,25.5 62,12 44.5,13 35.5,17 38.5,22 67,24 69,24 70,25 64,27 66,27 62,14 62,16 65.5,11 63.5,11 65,23.5 70.5,26.5 60.5,9.5
  pour Top (rank 2, no thermals): -1,51 -1,-1 90,-1 90,51
  pour Bottom (rank 2, no thermals): -3,52 -3,-1 90,-1 90,52
HB1_IN  (via drill 0.51)
  Top 0.2: R13.2 53,41 v54,40 | v65,25 68,25 69.5,26.5 69.5,28 68.04,29.46 HB_1.2
  Bottom 0.2: v65,25 63,25 61,27 61,39 60,40 v54,40
HB1_INH  (via drill 0.51)
  Top 0.2: R12.2 v56,41 | HB_1.3 68.33,30.73 v69.03,30.03
  Bottom 0.2: v56,41 60,41 61.39,39.61 61.39,27.61 63,26 69,26 69.53,26.53 69.53,29.53 v69.03,30.03
HB2_IN
  Top 0.2: HB_2.2 67.54,13.46 68,13 68,9.55 66.84,8.39 51.71,8.39 49.6,10.5 43.5,10.5 42,9 R10.2
HB2_INH
  Top 0.2: HB_2.3 67.27,14.73 68.5,13.5 68.5,9.5 67,8 51.55,8 49.66,9.89 44.11,9.89 44,10 42,8 42,6.5 41.5,6 R11.2
IN_1  (via drill 0.51)
  Top 0.2: CD74HCT.6 30.54,28.46 v31,28 | v51.5,47.5 52,48 53,48 R13.1
  Bottom 0.2: v31,28 31.5,27.5 31.5,26 32,25.5 37,25.5 38,26.5 38,31.5 34.5,35 26.5,35 24.5,37 24.5,39 25.5,40 49.45,40 51.5,42.05 v51.5,47.5
IN_2  (via drill 0.51)
  Top 0.2: R10.1 36.5,9 36,9.5 36,10 36.5,10.5 39.5,10.5 41,12 41,16.5 37.5,20 37.5,27 v37,27.5 | CD74HCT.3 29.73,32.27 30,32 30,30.5 30.5,30 v31,30
  Bottom 0.2: v31,30 31.5,30 34,27.5 v37,27.5
IN_M_1  (via drill 0.51)
  Top 0.2: STM32.30 21.25,23.75 v21,23.5 | CD74HCT.5 24.27,29.73 v24,30
  Bottom 0.2: v21,23.5 20,23.5 19.5,24 19.5,26.5 23,30 v24,30
IN_M_2  (via drill 0.51)
  Top 0.2: STM32.29 22.25,23.25 21,22 v20.5,22 | v26.5,32 26.5,33 27.04,33.54 CD74HCT.2
  Bottom 0.2: v20.5,22 20,22 19.5,22.5 19.5,23.45 19.11,23.84 19.11,26.66 22.84,30.39 22.89,30.39 23.5,31 25.5,31 v26.5,32
INH  (via drill 0.51)
  Top 0.2: CD74HCT.11 35,31 v35.5,31.5 | R11.1 36,6 35.5,6.5 35.5,10.5 36,11 39,11 40,12 40,16.5 36,20.5 v36,28.5 | v56,48 R12.1
  Bottom 0.2: v56,48 55.75,48.25 51.19,48.25 50.75,47.81 50.75,47.19 51.11,46.83 51.11,42.21 49.4,40.5 25.5,40.5 25.39,40.39 25.34,40.39 24.11,39.16 24.11,36.39 26,34.5 34,34.5 35.5,33 v35.5,31.5 35.5,29 v36,28.5
INH_M  (via drill 0.51)
  Top 0.2: STM32.24 23.75,20.75 v22.5,22 | v31,32 31.27,32.27 CD74HCT.12
  Bottom 0.2: v22.5,22 22,22.5 22,24 21.5,24.5 20.5,24.5 20,25 20,26.45 22.55,29 25,29 26.5,30.5 29,30.5 30,31.5 30.5,31.5 v31,32
IS_1  (via drill 0.51)
  Top 0.2: STM32.26 26.75,21.75 28,20.5 28,19.5 | R14.2 29,18 28,19 28,19.5 | C14.1 v62,41 | v69,34 68,34 67.46,34.54 HB_1.6 | 28,19.5 35,19.5 35.5,20 35.5,27.94 35.25,28.19 35.25,30.2 36.25,31.19 36.25,36.38 35.5,37.12 35.5,37.5 v36,38
  Bottom 0.2: v69,34 69,35 68,36 65,36 64,37 64,39 v62,41 63.5,41 65.5,43 65.5,46 65,46.5 58.05,46.5 50.16,38.61 36.61,38.61 v36,38
IS_2  (via drill 0.51)
  Top 0.2: 69,14 68.5,14.5 v68.5,18.5 68.46,18.54 HB_2.6 | 69,14 R9.2 | STM32.27 26.75,22.25 v27,22.5 | C15.1 69.5,11 69,11.5 69,14
  Bottom 0.2: v27,22.5 35.5,22.5 38,25 39,25 39.5,24.5 39.5,21.5 38.5,20.5 38.5,19.5 42,16 42,13 43,12 49.81,12 53.31,8.5 70.5,8.5 72,10 72,17.5 71,18.5 v68.5,18.5
L_1
  Top 0.2: R3.1 35,6 36.5,4.5 41.5,4.5 42.5,5.5 42.5,7.5 44.5,9.5 49.5,9.5 51.61,7.39 72.84,7.39 74.84,9.39 75.39,9.39 79,13 79,20.5 81.1,22.6 J1.7
L_2
  Top 0.2: R2.1 42,3 43,4 43,7.45 44.53,8.97 48.97,8.97 49,9 51,7 73,7 75,9 76,9 80,13 80,17.9 J1.6
N$1  (via drill 0.51)
  other vias: 68,32
N$2  (via drill 0.51)
  other vias: 70,32
NRST  (via drill 0.51)
  Top 0.2: STM32.7 18.25,17.25 v19,18
  Bottom 0.2: v19,18 23,18 26.5,14.5 33,14.5 37.5,10 49.4,10 52.9,6.5 72,6.5 74.5,9 76,9 80.04,13.04 82.65,13.04 82.69,13 86,13 87,14 87,20 86,21 J1.11
OSC_IN
  Top 0.2: STM32.5 17.25,13.25 15,11 R19.2
OSC_OUT
  Top 0.2: STM32.6 17.75,13.25 18,13 R20.2
PA0  (via drill 0.51)
  Top 0.2: STM32.14 21.75,14 v23,12.75 | v28,7.5 28,5.55 28.39,5.16 28.39,2.23 29.5,1.12 34.62,1.12 35.5,2 35.5,3 | 35.5,3 R1.1 | 35.5,3 R2.2
  Bottom 0.2: v23,12.75 23.5,12.25 26.75,12.25 27.5,11.5 27.5,9 28,8.5 v28,7.5
PA1  (via drill 0.51)
  Top 0.2: STM32.15 22.25,14.05 22.8,13.5 v24.5,13.5 | v28.75,10.5 28.75,9.25 29,9 | 29,9 R4.1 | R3.2 29.5,6 29,6.5 29,9
  Bottom 0.2: v24.5,13.5 26.5,13.5 28.75,11.25 v28.75,10.5
PC2  (via drill 0.51)
  Top 0.2: STM32.10 19.75,16.75 20.5,17.5 20.5,18.5 20,19 17.5,19 v17,18.5 | v10,26 R8.1 R7.2
  Bottom 0.2: v17,18.5 13,18.5 11,20.5 11,25 v10,26
PC5  (via drill 0.51)
  Top 0.2: STM32.25 25.69,21.25 v26.47,20.47 | v38.5,24 38.5,32 38,32.5 38,33 | 38,33 R18.1 | R15.2 41,33.5 40.5,33 38,33
  Bottom 0.2: v26.47,20.47 27.97,21.97 35.97,21.97 38,24 v38.5,24
Q_IN
  Top 0.2: R19.1 15,6 13,6 12,5 | QUARZ.2 12,3 12,5 | CQ2.1 12,5
Q_OUT
  Top 0.2: R20.1 18,6.5 20,4.5 | QUARZ.1 20.5,3 20,3.5 20,4.5 | 20,4.5 21,5.5 CQ1.1
SR1
  Top 0.2: R16.2 52.05,25.05 52.5,25.5 56,25.5 56.5,26 59.5,26 62,28.5 62,32.5 62.77,33.27 HB_1.5
SR2
  Top 0.2: R17.2 47.05,15.95 48,15 48,12 49.11,10.89 49.77,10.89 51.66,9 58.5,9 60.5,11 60.5,16.5 61.27,17.27 HB_2.5
SWCLK  (via drill 0.51)
  Top 0.2: STM32.49 14.25,24.75 14.5,24.5 14.5,23 16.5,21 v18.5,21
  Bottom 0.2: v18.5,21 22.5,21 24,19.5 37.55,19.5 41.5,15.55 41.5,12.5 42.61,11.39 49.87,11.39 53.26,8 55.5,8 55.53,8.03 70.97,8.03 73.34,10.39 73.39,10.39 77.1,14.1 J1.1
SWDIO  (via drill 0.51)
  Top 0.2: STM32.46 16.25,24.75 v17,24
  Bottom 0.2: v17,24 17,20 18,19 23,19 27,15 33.5,15 38,10.5 49.6,10.5 53.1,7 71.5,7 74,9.5 75.5,9.5 80,14 84,14 85.1,15.1 J1.10
T_1  (via drill 0.51)
  Top 0.2: STM32.11 20.25,13.25 v20,13 | C21.1 9,20 v10,19 10,22 9,23 R6.1
  Bottom 0.2: v10,19 10,15 12,13 v20,13 20,6.5 21,5.5 31.5,5.5 35.5,9.5 49.2,9.5 53.7,5 J2.1
TRACESWO  (via drill 0.51)
  Top 0.2: STM32.55 14.25,21.75 16,20 v21,20
  Bottom 0.2: J1.12 85.1,23.6 83,21.5 83,17 81,15 80,15 75,10 73.5,10 71,7.5 53.2,7.5 49.7,11 42,11 41,12 41,15.5 37.5,19 23.55,19 22.55,20 v21,20
U_RX  (via drill 0.51)
  Top 0.2: STM32.17 26.25,17.25 v26.5,17
  Bottom 0.2: v26.5,17 28,15.5 37.5,15.5 J4.1
U_TX
  Top 0.2: STM32.16 22.75,14.25 23,14 23.94,14 24.19,14.25 24.81,14.25 25.06,14 27.5,14 28,13.5 35,13.5 35.04,13.46 J4.2
V5  (via drill 0.51)
  Top 0.2: 30,36 30.5,36.5 v34,36.5 | v64.5,44.5 69.95,44.5 79.95,34.5 80.5,34.5 81.1,33.9 J1.9
  Top 0.3: VREG_5.4 25.5,44 25,43.5 25,39.5 25.89,38.61 28.39,38.61 | 28.39,38.61 C3.2 | 28.39,38.61 28.39,37.61 30,36 31.19,34.81 CD74HCT.14
  Bottom 0.2: v64.5,44.5 63,46 58.1,46 50.32,38.22 38.72,38.22 37,36.5 v34,36.5
V12
  Top 0.5: C16.2 47,40 | R15.1 41,39.5 42.75,41.25 | CH1.1 59,38.26 | C17.2 63.5,23 65,21.5 | CH3.1 70.6,20.4 70.5,20.5
  Top 0.8: 39.7,46.3 41,45 41,43 42.75,41.25 44,40 47,40 52,40 53.74,38.26 59,38.26 68.2,38.26 C13.1 | 39.7,46.3 37,46.3 | 37,46.3 VREG_5.3 | 39.7,46.3 38,48 24,48 22.3,46.3 | VREG_33.3 22.3,46.3 | C2.1 23,45.6 22.3,46.3 | C4.2 37,46.3
  pour Top (no thermals): 63.5,19.5 71.5,19.5 74.5,22.5 74.5,27 75,27.5 78.5,27.5 79,28 79,34 78.5,34.5 75,34.5 74.5,35 74.5,35.5 71,39 64.5,39 63.5,38 63.5,35.5 70,35.5 71.5,34 71.5,24 70,22.5 64.5,22.5 63.5,21.5
V33  (via drill 0.51)
  Top 0.2: L1.2 4,11 | 4,11 3.5,11.5 3.5,12 4,12.5 9,12.5 9,14 | 4,11 4,9 2.5,7.5 2.5,1.5 2.88,1.12 19.12,1.12 v20,2 | v69,2.5 70,3.5 J3.2 | STM32.19 23.75,18.25 23,19 23,20 22,21 20,21 18.25,22.75 17.75,22.75
  Top 0.3: 17,38 17,39 14.4,41.6 11.9,41.6 11.5,42 | 17,38 17,34 | 17,34 17,32 | 17,32 17,31 15.25,29.25 15.25,27 | C_CAN.1 17,32 | C9.1 17,38 | CAN_T.3 17.64,33.37 17,34 | 15.25,27 STM32.48 15.25,23.75 16.25,22.75 17.75,22.75 19.75,24.75 STM32.32 25.75,24.75 26,25 26,25.5 26.5,26 28.5,26 29,25.5 29,24.5 29.5,24 C8.1 | STM32.19 26.75,18.25 28,17 28,16 29,15 C7.1 | 11.5,42 11.5,43.5 12,44 VREG_33.4 | 15.25,27 12,27 11.5,26.5 11.5,17.25 | C10.1 7.65,17.25 11.5,17.25 | 11.5,17.25 STM32.64 14.75,17.25 15.25,16.75 STM32.1 15.25,14.25 15,14 9,14 C11.1 | C1.1 9,38 9.5,38.5 9.5,40 11.5,42
  Bottom 0.2: v20,2 41.5,2 42.38,1.12 67,1.12 67.62,1.12 | 67.62,1.12 v69,2.5 | J1.2 81.95,21 83.5,22.55 83.5,26.16 83.94,26.6 86.76,26.6 87.39,25.98 87.39,7.43 81.08,1.12 67.62,1.12
V_MOT_MIN  (via drill 0.51)
  Top 0.5: TB1.1 C19.2 | C17.1 57,23 56.5,22.5 56.5,19
  other vias: 52,19.5 52,18 52,16.5 52,15 52,13.5 52,12 58,19.5 58,18 58,16.5 58,15 58,13.5 58,12 56.5,19.5 56.5,18 56.5,16.5 56.5,15 56.5,13.5 56.5,12 55,19.5 55,18 55,16.5 55,15 55,13.5 55,12 53.5,19.5 53.5,18 53.5,16.5 53.5,15 53.5,13.5 53.5,12
  pour Top (no thermals): 42,24 47,24 50,21 59,21 59,11 51,11 51,18 49,18 46,21 42,21 41.5,21.5 41.5,23.5
  pour Bottom (no thermals): 59,21 50.5,21 50,21 47,24 42,24 41.5,23.5 41.5,21.5 41.5,18.5 44.5,15.5 44.5,14 45,13.5 45.5,13.5 46.5,12.5 49.5,12.5 50,12.5 51.5,11 59,11
V_MOT_PL  (via drill 0.51)
  Top 0.5: TB1.2 44,29.08 44,30.5 | 44,30.5 C18.2 | C16.1 47,31.5 46,30.5 44,30.5
  other vias: 52,36 52,34.5 52,33 52,31.5 52,30 52,28.5 58,36 58,34.5 58,33 58,31.5 58,30 58,28.5 56.5,36 56.5,34.5 56.5,33 56.5,31.5 56.5,30 56.5,28.5 55,36 55,34.5 55,33 55,31.5 55,30 55,28.5 53.5,36 53.5,34.5 53.5,33 53.5,31.5 53.5,30 53.5,28.5
  pour Top (no thermals): 59,37 51,37 51,30 42,30 41.5,29.5 41.5,27.5 42,27 59,27
  pour Bottom (no thermals): 59,37 41,37 41,27 59,27
VCAP_1
  Top 0.2: C6.1 29,21 28.5,21.5 28.5,25 28,25.5 27,25.5 26.5,25 26.5,24.5 26.25,24.25 STM32.31
VCAP_2  (via drill 0.51)
  Top 0.2: STM32.47 15.75,28.25 v16.5,29 | v16,34 15,35 C5.1
  Bottom 0.2: v16.5,29 16.5,33.5 v16,34
VDDA  (via drill 0.51)
  Top 0.2: STM32.13 21.25,13.25 22.5,12 | 22.5,12 24,12 | 24,12 C12.1 | C20.1 24,12 | 22.5,12 v19,12 | v10,12 9,11 L1.1
  Bottom 0.2: v19,12 v10,12
Z_1  (via drill 0.51)
  Top 0.2: R7.1 3,29 2.5,28.5 2.5,10 v3,9.5
  Bottom 0.2: v3,9.5 16,9.5 21,4.5 32,4.5 36,8.5 45,8.5 45.5,9 49,9 52,6 52,3.5 53,2.5 58,2.5 59,3.5 J2.2

### Text on the board
tPlace: TSE-BOARD